# Altium project PCB_KAT_MagicMyc.PrjPcb
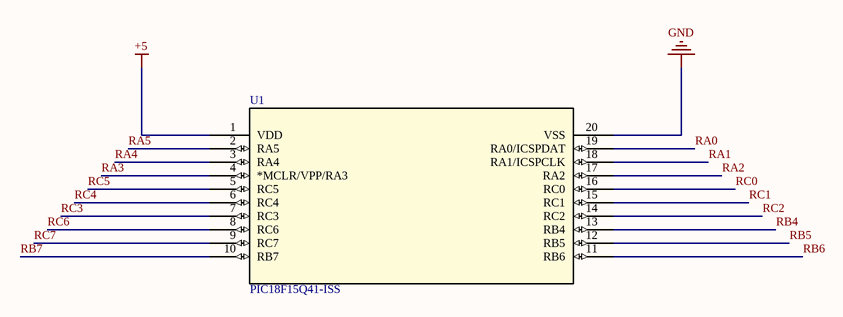
[diagram p0: Sheet1.SchDoc]
1 sheet, 1 parts. Net scope: global (net labels, ports and power ports of the same name join across sheets).
Board file: PCB1.PcbDoc

## Sheet Sheet1.SchDoc
size A4; SheetNumber: 1; SheetTotal: 1

### Parts
U1  PIC18F15Q41-ISS  [SSOP20_SS_MCH]

### Nets
+5: U1.1(VDD)
GND: U1.20(VSS)
RA0: U1.19(RA0/ICSPDAT)
RA1: U1.18(RA1/ICSPCLK)
RA2: U1.17(RA2)
RA3: U1.4(*MCLR/VPP/RA3)
RA4: U1.3(RA4)
RA5: U1.2(RA5)
RB4: U1.13(RB4)
RB5: U1.12(RB5)
RB6: U1.11(RB6)
RB7: U1.10(RB7)
RC0: U1.16(RC0)
RC1: U1.15(RC1)
RC2: U1.14(RC2)
RC3: U1.7(RC3)
RC4: U1.6(RC4)
RC5: U1.5(RC5)
RC6: U1.8(RC6)
RC7: U1.9(RC7)

### Library data of the parts
U1 = PIC18F15Q41-ISS: No Description Available; Mfr_Name: Microchip; RefDes: RefDes; Type: Type; Supplier 1: Newark; Supplier Part Number 1: 88AH7094